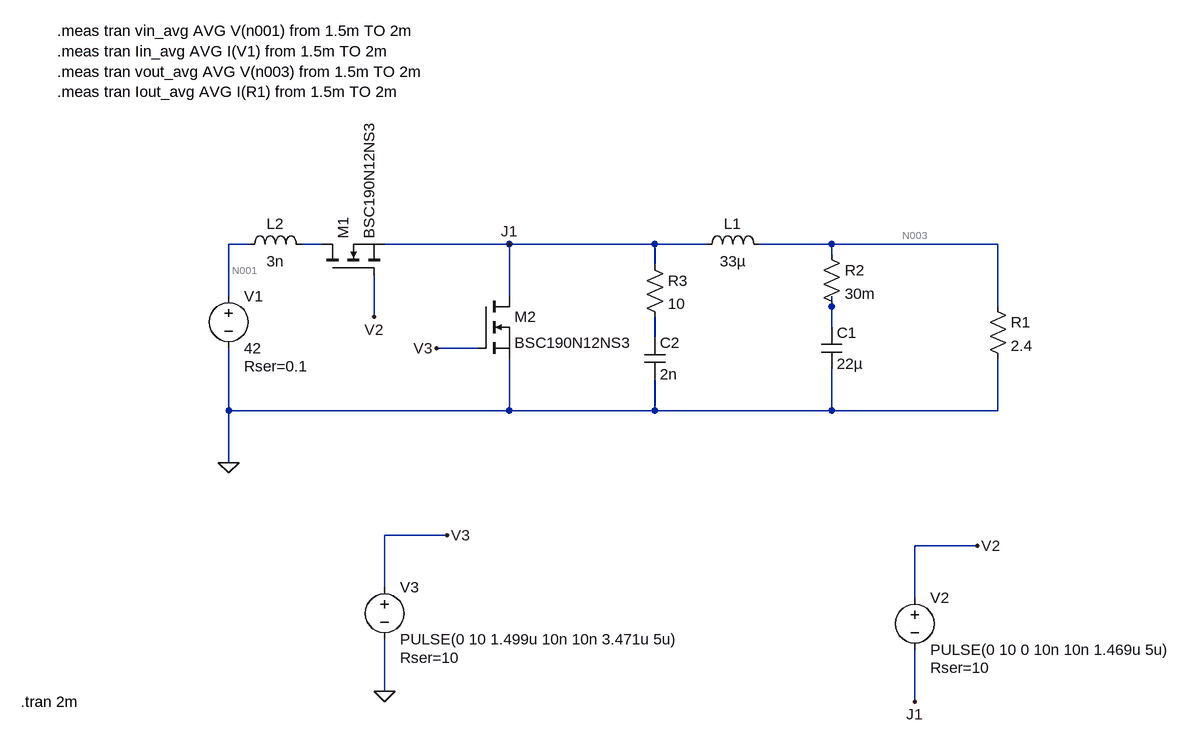
[diagram p0: schematic 60W synchronous buck non ideal case (V3).asc]
60W synchronous buck non ideal case (V3).asc, the LTspice schematic file:
Version 4.1
SHEET 1 976 680
WIRE -528 -112 -560 -112
WIRE -416 -112 -448 -112
WIRE -128 -112 -320 -112
WIRE 96 -112 -128 -112
WIRE 176 -112 96 -112
WIRE 368 -112 256 -112
WIRE 624 -112 368 -112
WIRE 368 -96 368 -112
WIRE 96 -80 96 -112
WIRE -560 -32 -560 -112
WIRE -128 -32 -128 -112
WIRE 368 -16 368 -32
WIRE 624 -16 624 -112
WIRE -336 0 -336 -64
WIRE 368 16 368 -16
WIRE 96 32 96 0
WIRE -176 48 -240 48
WIRE -560 144 -560 48
WIRE -128 144 -128 64
WIRE -128 144 -560 144
WIRE 96 144 96 96
WIRE 96 144 -128 144
WIRE 368 144 368 80
WIRE 368 144 96 144
WIRE 624 144 624 64
WIRE 624 144 368 144
WIRE -560 224 -560 144
WIRE -224 336 -320 336
WIRE 592 352 496 352
WIRE -320 416 -320 336
WIRE 496 432 496 352
WIRE -320 576 -320 496
WIRE 496 592 496 512
FLAG -336 0 V2
FLAG -560 224 0
FLAG -240 48 V3
FLAG 496 592 J1
FLAG 592 352 V2
FLAG -224 336 V3
FLAG -128 -112 J1
FLAG -320 576 0
SYMBOL res 608 -32 R0
SYMATTR InstName R1
SYMATTR Value 2.4
SYMBOL ind 160 -96 R270
WINDOW 0 32 56 VTop 2
WINDOW 3 5 56 VBottom 2
SYMATTR InstName L1
SYMATTR Value 33µ
SYMATTR SpiceLine Rser=50m
SYMBOL cap 352 16 R0
SYMATTR InstName C1
SYMATTR Value 22µ
SYMBOL res 352 -112 R0
SYMATTR InstName R2
SYMATTR Value 30m
SYMBOL res 80 -96 R0
SYMATTR InstName R3
SYMATTR Value 10
SYMBOL cap 80 32 R0
SYMATTR InstName C2
SYMATTR Value 2n
SYMBOL voltage -560 -48 R0
WINDOW 123 0 0 Left 0
WINDOW 39 24 124 Left 2
SYMATTR SpiceLine Rser=0.1
SYMATTR InstName V1
SYMATTR Value 42
SYMBOL nmos -416 -64 R270
SYMATTR InstName M1
SYMATTR Value BSC190N12NS3
SYMBOL ind -544 -96 R270
WINDOW 0 32 56 VTop 2
WINDOW 3 5 56 VBottom 2
SYMATTR InstName L2
SYMATTR Value 3n
SYMATTR SpiceLine Rser=1m
SYMBOL nmos -176 -32 R0
SYMATTR InstName M2
SYMATTR Value BSC190N12NS3
SYMBOL voltage 496 416 R0
WINDOW 123 0 0 Left 0
WINDOW 39 24 124 Left 2
SYMATTR SpiceLine Rser=10
SYMATTR InstName V2
SYMATTR Value PULSE(0 10 0 10n 10n 1.469u 5u)
SYMBOL voltage -320 400 R0
WINDOW 123 0 0 Left 0
WINDOW 39 24 124 Left 2
SYMATTR SpiceLine Rser=10
SYMATTR InstName V3
SYMATTR Value PULSE(0 10 1.499u 10n 10n 3.471u 5u)
TEXT -880 592 Left 2 !.tran 2m
TEXT -824 -440 Left 2 !.meas tran vin_avg AVG V(n001) from 1.5m TO 2m\n.meas tran Iin_avg AVG I(V1) from 1.5m TO 2m\n.meas tran vout_avg AVG V(n003) from 1.5m TO 2m\n.meas tran Iout_avg AVG I(R1) from 1.5m TO 2m

The netlist it stands for:
* 60W synchronous buck non ideal case (V3).asc
R1 N003 0 2.4
L1 J1 N003 33µ Rser=50m
C1 N004 0 22µ
R2 N003 N004 30m
R3 J1 N005 10
C2 N005 0 2n
V1 N001 0 42 Rser=0.1
M1 N002 V2 J1 J1 BSC190N12NS3
L2 N001 N002 3n Rser=1m
M2 J1 V3 0 0 BSC190N12NS3
V2 V2 J1 PULSE(0 10 0 10n 10n 1.469u 5u) Rser=10
V3 V3 0 PULSE(0 10 1.499u 10n 10n 3.471u 5u) Rser=10
.model NMOS NMOS
.model PMOS PMOS
.lib standard.mos
.tran 2m
.meas tran vin_avg AVG V(n001) from 1.5m TO 2m
.meas tran Iin_avg AVG I(V1) from 1.5m TO 2m
.meas tran vout_avg AVG V(n003) from 1.5m TO 2m
.meas tran Iout_avg AVG I(R1) from 1.5m TO 2m
.backanno
.end